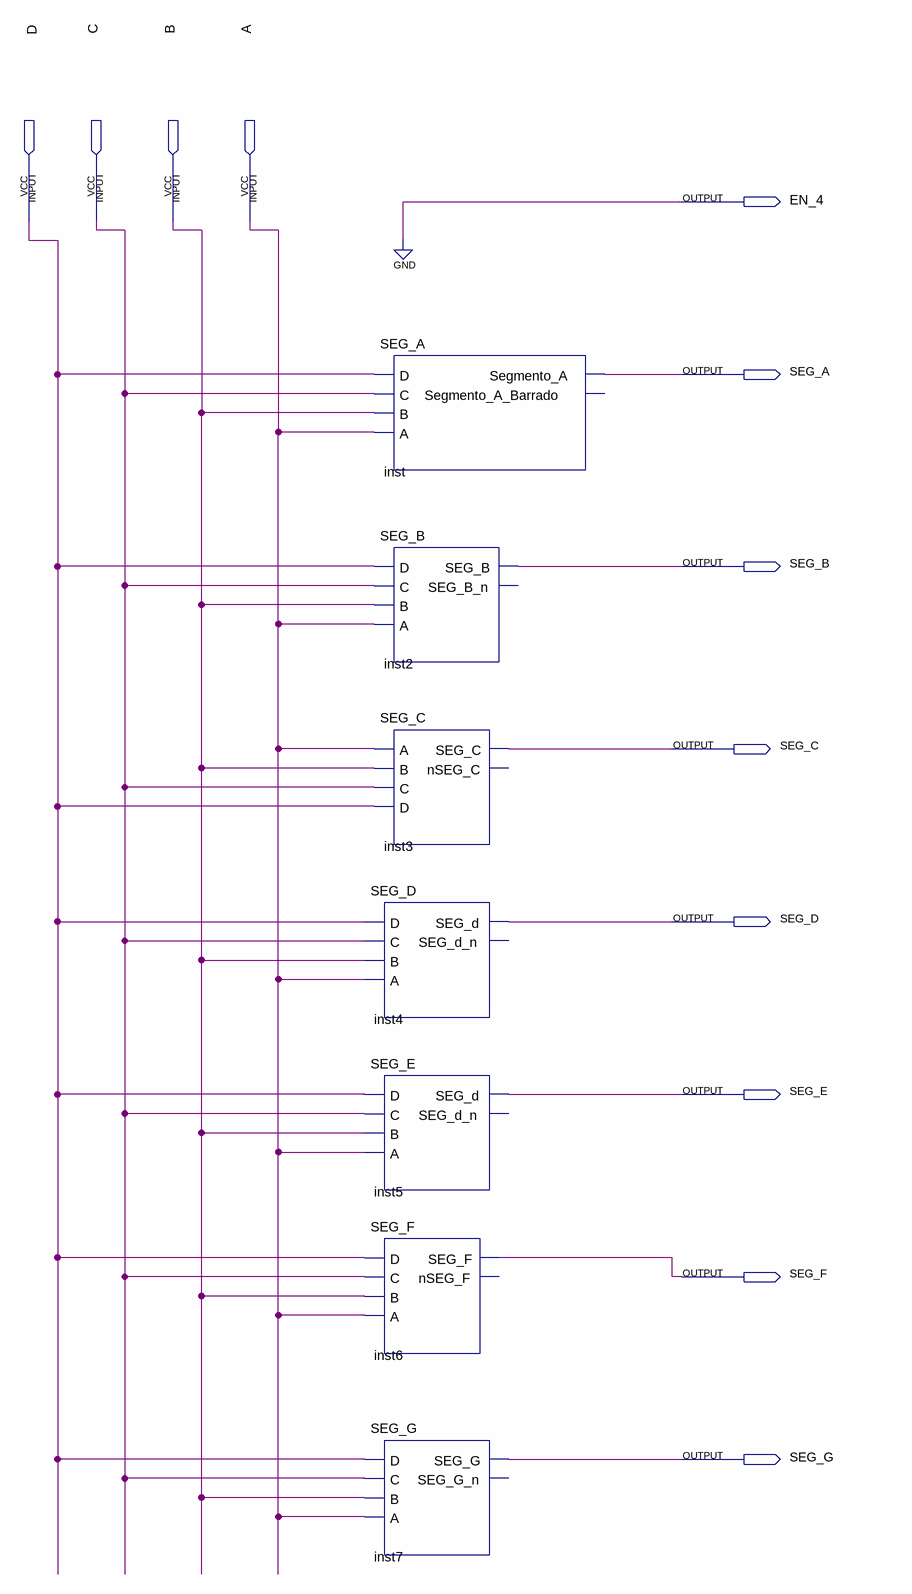
[diagram p0: schematic sheet]
// Quartus schematic Display.bdf as structural Verilog: 7 symbols, 12 pins
module Display (
  input  D,
  input  C,
  input  B,
  input  A,
  output EN_4,
  output SEG_A,
  output SEG_B,
  output SEG_C,
  output SEG_D,
  output SEG_E,
  output SEG_F,
  output SEG_G
);

  SEG_A inst (.D(D), .C(C), .B(B), .A(A), .Segmento_A(SEG_A));  // open: Segmento_A_Barrado
  SEG_B inst2 (.D(D), .C(C), .B(B), .A(A), .SEG_B(SEG_B));  // open: SEG_B_n
  SEG_C inst3 (.A(A), .B(B), .C(C), .D(D), .SEG_C(SEG_C));  // open: nSEG_C
  SEG_D inst4 (.D(D), .C(C), .B(B), .A(A), .SEG_d(SEG_D));  // open: SEG_d_n
  SEG_E inst5 (.D(D), .C(C), .B(B), .A(A), .SEG_d(SEG_E));  // open: SEG_d_n
  SEG_F inst6 (.D(D), .C(C), .B(B), .A(A), .SEG_F(SEG_F));  // open: nSEG_F
  SEG_G inst7 (.D(D), .C(C), .B(B), .A(A), .SEG_G(SEG_G));  // open: SEG_G_n

  assign EN_4 = 1'b0;
endmodule
